# Altium schematic sheet CPU_GPIOG_I_VDD.SchDoc
size A4
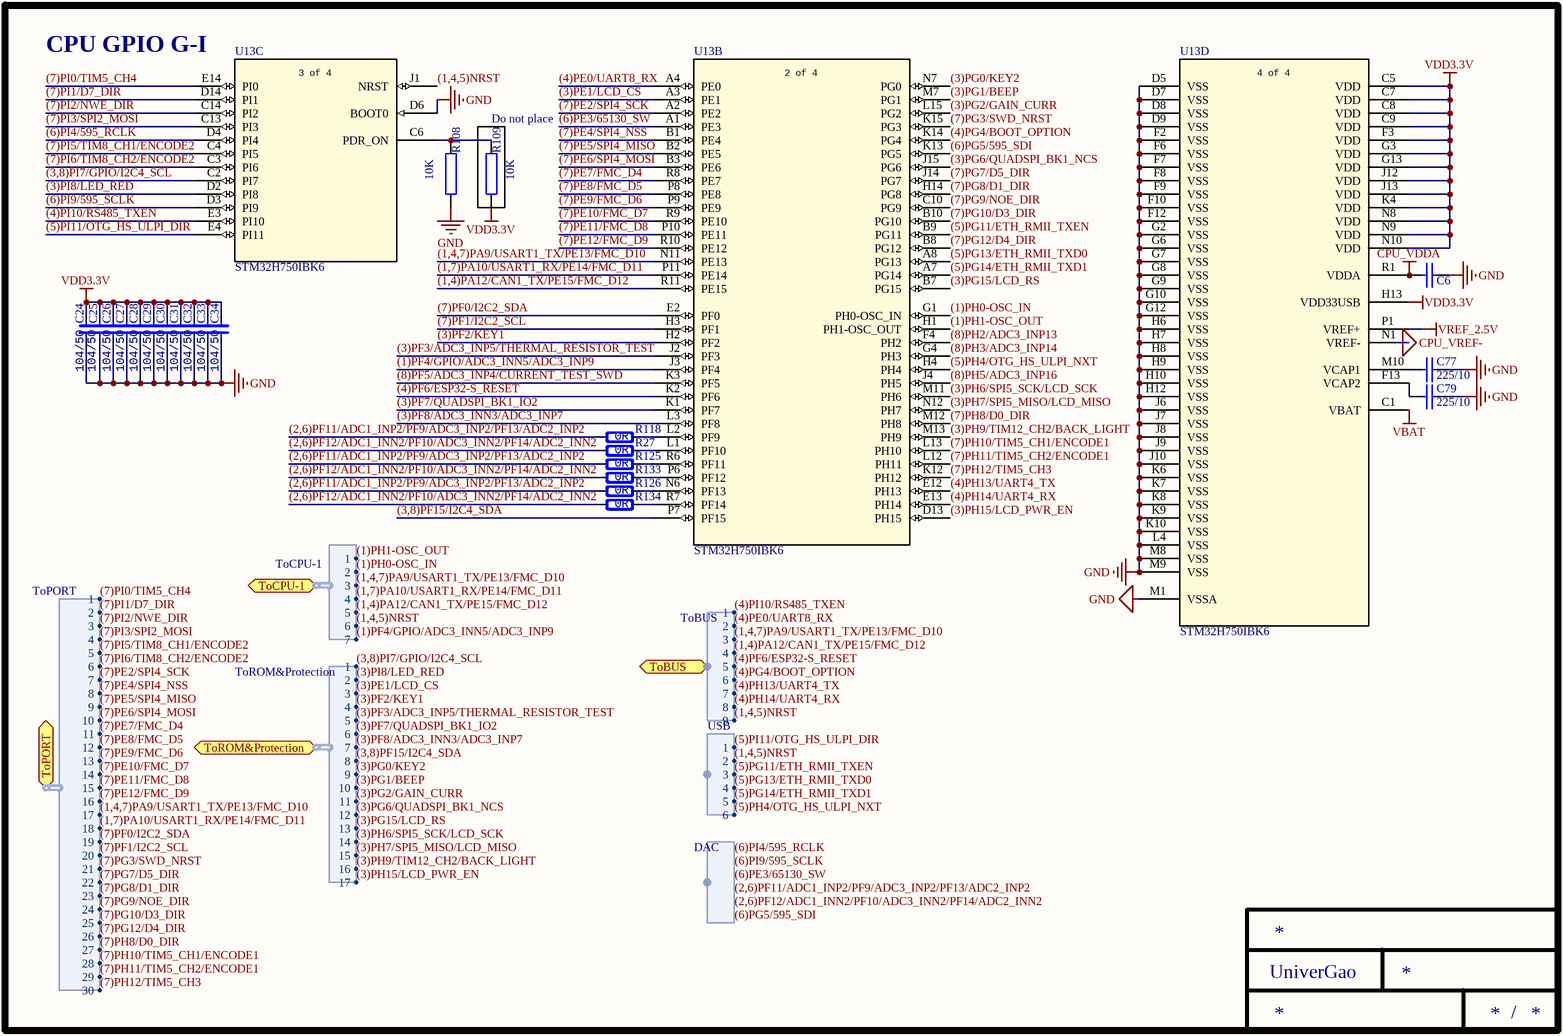
[diagram p0: CPU_GPIOG_I_VDD.SchDoc]

## Parts
C6  104/50  [0603]  (value not drawn)
C24  value 104/50  [CAP_0603]  (hidden comment: C0603)
C25  value 104/50  [CAP_0603]  (hidden comment: C0603)
C26  value 104/50  [CAP_0603]  (hidden comment: C0603)
C27  value 104/50  [CAP_0603]  (hidden comment: C0603)
C28  value 104/50  [CAP_0603]  (hidden comment: C0603)
C29  value 104/50  [CAP_0603]  (hidden comment: C0603)
C30  value 104/50  [CAP_0603]  (hidden comment: C0603)
C31  value 104/50  [CAP_0603]  (hidden comment: C0603)
C32  value 104/50  [CAP_0603]  (hidden comment: C0603)
C33  value 104/50  [CAP_0603]  (hidden comment: C0603)
C34  value 104/50  [CAP_0603]  (hidden comment: C0603)
C77  225/10  [0603]
C79  225/10  [0603]
R27  value 0R  [RES_0603]  (hidden comment: R0603)
R108  10K  [0603]
R109  10K  [0603]
R118  value 0R  [RES_0603]  (hidden comment: R0603)
R125  value 0R  [RES_0603]  (hidden comment: R0603)
R126  value 0R  [RES_0603]  (hidden comment: R0603)
R133  value 0R  [RES_0603]  (hidden comment: R0603)
R134  value 0R  [RES_0603]  (hidden comment: R0603)
U13  STM32H750IBK6  [UFBGA 10X10 P 0.65 176+25]  (parts B,C,D of 4)

## Ports
ToBUS (harness ToBUS), ToCPU-1 (harness ToCPU-1), ToPORT (harness ToPORT), ToROM&Protection (harness ToROM&Protection)

## Harnesses
ToPORT: 1, 2, 3, 4, 5, 6, 7, 8, 9, 10, 11, 12, 13, 14, 15, 16, 17, 18, 19, 20, 21, 22, 23, 24, 25, 26, 27, 28, 29, 30
ToCPU-1: 1, 2, 3, 4, 5, 6, 7
ToROM&Protection: 1, 2, 3, 4, 5, 6, 7, 8, 9, 10, 11, 12, 13, 14, 15, 16, 17
ToBUS: 1, 2, 3, 4, 5, 6, 7, 8, 9
USB: 1, 2, 3, 4, 5, 6
DAC: 

## Nets
CPU_VDDA: C6.2 U13.R1(VDDA)
CPU_VREF-: U13.N1(VREF-)
GND: C6.1 C24.1 C25.1 C26.1 C27.1 C28.1 C29.1 C30.1 C31.1 C32.1 C33.1 C34.1 C77.1 C79.1 R108.2 U13.D5(VSS) U13.D6(BOOT0) U13.D7(VSS) U13.D8(VSS) U13.D9(VSS) U13.F2(VSS) U13.F6(VSS) U13.F7(VSS) U13.F8(VSS) U13.F9(VSS) U13.F10(VSS) U13.F12(VSS) U13.G2(VSS) U13.G6(VSS) U13.G7(VSS) U13.G8(VSS) U13.G9(VSS) U13.G10(VSS) U13.G12(VSS) U13.H6(VSS) U13.H7(VSS) U13.H8(VSS) U13.H9(VSS) U13.H10(VSS) U13.H12(VSS) U13.J6(VSS) U13.J7(VSS) U13.J8(VSS) U13.J9(VSS) U13.J10(VSS) U13.K6(VSS) U13.K7(VSS) U13.K8(VSS) U13.K9(VSS) U13.K10(VSS) U13.L4(VSS) U13.M1(VSSA) U13.M8(VSS) U13.M9(VSS)
VBAT: U13.C1(VBAT)
VDD3.3V: C24.2 C25.2 C26.2 C27.2 C28.2 C29.2 C30.2 C31.2 C32.2 C33.2 C34.2 R109.2 U13.C5(VDD) U13.C7(VDD) U13.C8(VDD) U13.C9(VDD) U13.F3(VDD) U13.G3(VDD) U13.G13(VDD) U13.H13(VDD33USB) U13.J12(VDD) U13.J13(VDD) U13.K4(VDD) U13.N8(VDD) U13.N9(VDD) U13.N10(VDD)
VREF_2.5V: U13.P1(VREF+)
(1)PF4/GPIO/ADC3_INN5/ADC3_INP9: U13.J3(PF4) ; port ToCPU-1.7
(1)PH0-OSC_IN: U13.G1(PH0-OSC_IN) ; port ToCPU-1.2
(1)PH1-OSC_OUT: U13.H1(PH1-OSC_OUT) ; port ToCPU-1.1
(1,4)PA12/CAN1_TX/PE15/FMC_D12: U13.R11(PE15) ; port ToCPU-1.5, port ToBUS.4
(1,4,5)NRST: U13.J1(NRST) ; port ToCPU-1.6, port ToBUS.9, harness USB.2
(1,4,7)PA9/USART1_TX/PE13/FMC_D10: U13.N11(PE13) ; port ToPORT.17, port ToCPU-1.3, port ToBUS.3
(1,7)PA10/USART1_RX/PE14/FMC_D11: U13.P11(PE14) ; port ToPORT.18, port ToCPU-1.4
(2,6)PF11/ADC1_INP2/PF9/ADC3_INP2/PF13/ADC2_INP2: R118.1 R125.1 R126.1
(2,6)PF12/ADC1_INN2/PF10/ADC3_INN2/PF14/ADC2_INN2: R27.1 R133.1 R134.1
(3)PE1/LCD_CS: U13.A3(PE1) ; port ToROM&Protection.3
(3)PF2/KEY1: U13.H2(PF2) ; port ToROM&Protection.4
(3)PF3/ADC3_INP5/THERMAL_RESISTOR_TEST: U13.J2(PF3) ; port ToROM&Protection.5
(3)PF7/QUADSPI_BK1_IO2: U13.K1(PF7) ; port ToROM&Protection.6
(3)PF8/ADC3_INN3/ADC3_INP7: U13.L3(PF8) ; port ToROM&Protection.7
(3)PG0/KEY2: U13.N7(PG0) ; port ToROM&Protection.9
(3)PG1/BEEP: U13.M7(PG1) ; port ToROM&Protection.10
(3)PG2/GAIN_CURR: U13.L15(PG2) ; port ToROM&Protection.11
(3)PG6/QUADSPI_BK1_NCS: U13.J15(PG6) ; port ToROM&Protection.12
(3)PG15/LCD_RS: U13.B7(PG15) ; port ToROM&Protection.13
(3)PH6/SPI5_SCK/LCD_SCK: U13.M11(PH6) ; port ToROM&Protection.14
(3)PH7/SPI5_MISO/LCD_MISO: U13.N12(PH7) ; port ToROM&Protection.15
(3)PH9/TIM12_CH2/BACK_LIGHT: U13.M13(PH9) ; port ToROM&Protection.16
(3)PH15/LCD_PWR_EN: U13.D13(PH15) ; port ToROM&Protection.17
(3)PI8/LED_RED: U13.D2(PI8) ; port ToROM&Protection.2
(3,8)PF15/I2C4_SDA: U13.P7(PF15) ; port ToROM&Protection.8
(3,8)PI7/GPIO/I2C4_SCL: U13.C2(PI7) ; port ToROM&Protection.1
(4)PE0/UART8_RX: U13.A4(PE0) ; port ToBUS.2
(4)PF6/ESP32-S_RESET: U13.K2(PF6) ; port ToBUS.5
(4)PG4/BOOT_OPTION: U13.K14(PG4) ; port ToBUS.6
(4)PH13/UART4_TX: U13.E12(PH13) ; port ToBUS.7
(4)PH14/UART4_RX: U13.E13(PH14) ; port ToBUS.8
(4)PI10/RS485_TXEN: U13.E3(PI10) ; port ToBUS.1
(5)PG11/ETH_RMII_TXEN: U13.B9(PG11) ; harness USB.3
(5)PG13/ETH_RMII_TXD0: U13.A8(PG13) ; harness USB.4
(5)PG14/ETH_RMII_TXD1: U13.A7(PG14) ; harness USB.5
(5)PH4/OTG_HS_ULPI_NXT: U13.H4(PH4) ; harness USB.6
(5)PI11/OTG_HS_ULPI_DIR: U13.E4(PI11) ; harness USB.1
(6)PE3/65130_SW: U13.A1(PE3)
(6)PG5/595_SDI: U13.K13(PG5)
(6)PI4/595_RCLK: U13.D4(PI4)
(6)PI9/595_SCLK: U13.D3(PI9)
(7)PE2/SPI4_SCK: U13.A2(PE2) ; port ToPORT.7
(7)PE4/SPI4_NSS: U13.B1(PE4) ; port ToPORT.8
(7)PE5/SPI4_MISO: U13.B2(PE5) ; port ToPORT.9
(7)PE6/SPI4_MOSI: U13.B3(PE6) ; port ToPORT.10
(7)PE7/FMC_D4: U13.R8(PE7) ; port ToPORT.11
(7)PE8/FMC_D5: U13.P8(PE8) ; port ToPORT.12
(7)PE9/FMC_D6: U13.P9(PE9) ; port ToPORT.13
(7)PE10/FMC_D7: U13.R9(PE10) ; port ToPORT.14
(7)PE11/FMC_D8: U13.P10(PE11) ; port ToPORT.15
(7)PE12/FMC_D9: U13.R10(PE12) ; port ToPORT.16
(7)PF0/I2C2_SDA: U13.E2(PF0) ; port ToPORT.19
(7)PF1/I2C2_SCL: U13.H3(PF1) ; port ToPORT.20
(7)PG3/SWD_NRST: U13.K15(PG3) ; port ToPORT.21
(7)PG7/D5_DIR: U13.J14(PG7) ; port ToPORT.22
(7)PG8/D1_DIR: U13.H14(PG8) ; port ToPORT.23
(7)PG9/NOE_DIR: U13.C10(PG9) ; port ToPORT.24
(7)PG10/D3_DIR: U13.B10(PG10) ; port ToPORT.25
(7)PG12/D4_DIR: U13.B8(PG12) ; port ToPORT.26
(7)PH8/D0_DIR: U13.M12(PH8) ; port ToPORT.27
(7)PH10/TIM5_CH1/ENCODE1: U13.L13(PH10) ; port ToPORT.28
(7)PH11/TIM5_CH2/ENCODE1: U13.L12(PH11) ; port ToPORT.29
(7)PH12/TIM5_CH3: U13.K12(PH12) ; port ToPORT.30
(7)PI0/TIM5_CH4: U13.E14(PI0) ; port ToPORT.1
(7)PI1/D7_DIR: U13.D14(PI1) ; port ToPORT.2
(7)PI2/NWE_DIR: U13.C14(PI2) ; port ToPORT.3
(7)PI3/SPI2_MOSI: U13.C13(PI3) ; port ToPORT.4
(7)PI5/TIM8_CH1/ENCODE2: U13.C4(PI5) ; port ToPORT.5
(7)PI6/TIM8_CH2/ENCODE2: U13.C3(PI6) ; port ToPORT.6
(8)PF5/ADC3_INP4/CURRENT_TEST_SWD: U13.K3(PF5)
(8)PH2/ADC3_INP13: U13.F4(PH2)
(8)PH3/ADC3_INP14: U13.G4(PH3)
(8)PH5/ADC3_INP16: U13.J4(PH5)
NetC77_2: C77.2 U13.M10(VCAP1)
NetC79_2: C79.2 U13.F13(VCAP2)
NetR27_2: R27.2 U13.L1(PF10)
NetR108_1: R108.1 R109.1 U13.C6(PDR_ON)
NetR118_2: R118.2 U13.L2(PF9)
NetR125_2: R125.2 U13.R6(PF11)
NetR126_2: R126.2 U13.N6(PF13)
NetR133_2: R133.2 U13.P6(PF12)
NetR134_2: R134.2 U13.R7(PF14)

## Notes on the sheet
- (near U13) CPU GPIO G-I
- (near R109) Do not place
- Labels drawn without touching a wire or pin: (2,6)PF11/ADC1_INP2/PF9/ADC3_INP2/PF13/ADC2_INP2, (2,6)PF12/ADC1_INN2/PF10/ADC3_INN2/PF14/ADC2_INN2, (6)PE3/65130_SW, (6)PG5/595_SDI, (6)PI4/595_RCLK, (6)PI9/595_SCLK
- UniverGao
- /
- (in symbol STM32H750IBK6, part B) 2 of 4
- (in symbol STM32H750IBK6, part C) 3 of 4
- (in symbol STM32H750IBK6, part D) 4 of 4

## Library data of the parts
C6 C77 C79 = CAP1
C24-C34 = Cap_0603: Capacitor; Specification: X7R, ±10%, 16V; Note: ±10%; Type: 0603; Manufacturer: *
R27 R118 R125 R126 R133 R134 = Res_0603: Resistor; Specification: ±1%; Manufacturer: *; Note: ±1%; Type: 0603
R108 = RES
R109 = RES: 10K(Do not place)
U13 = STM32H750IBK6: No Description Available; Mfr_Name: STMicroelectronics; Copyright: Copyright (C) 2022 Ultra Librarian. All rights reserved.; Manufacturer_Part_Number: STM32H750IBK6; RefDes: RefDes; Type: DEV